# Altium schematic sheet pikobasic.SchDoc
size A
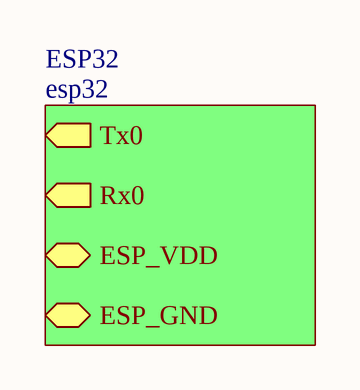
[diagram p0: pikobasic.SchDoc]

## Sub-sheets
ESP32 = esp32: Tx0 (out), Rx0 (out), ESP_VDD, ESP_GND